# Altium project IF GAIN.PrjPcb
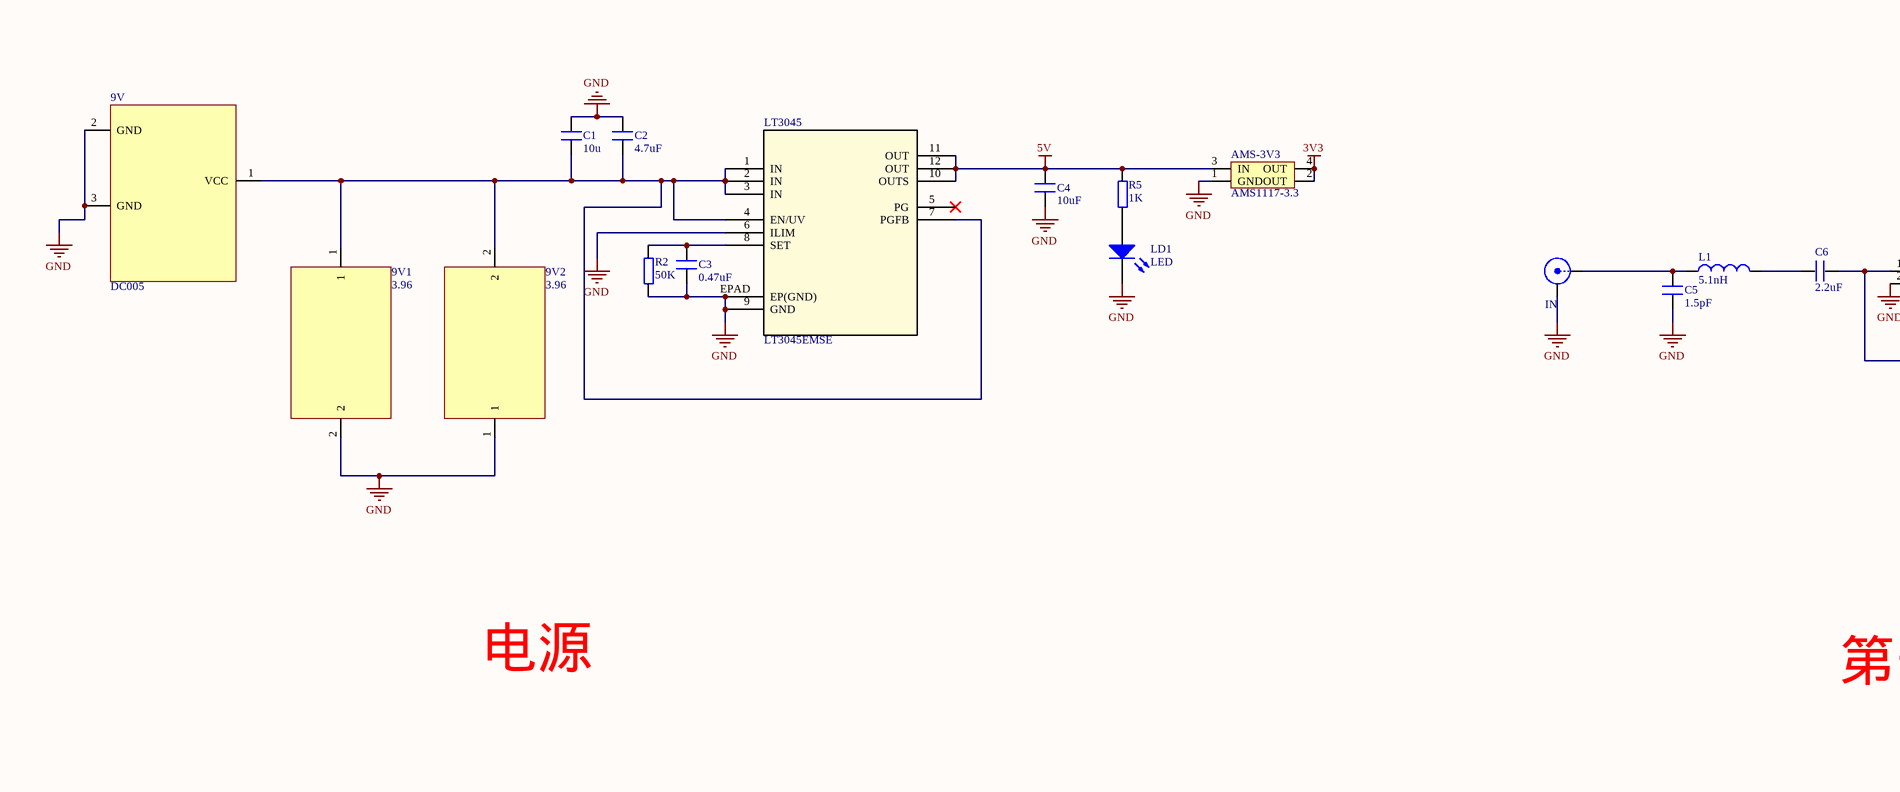
[diagram p0: IF GAIN].SchDoc, top left]
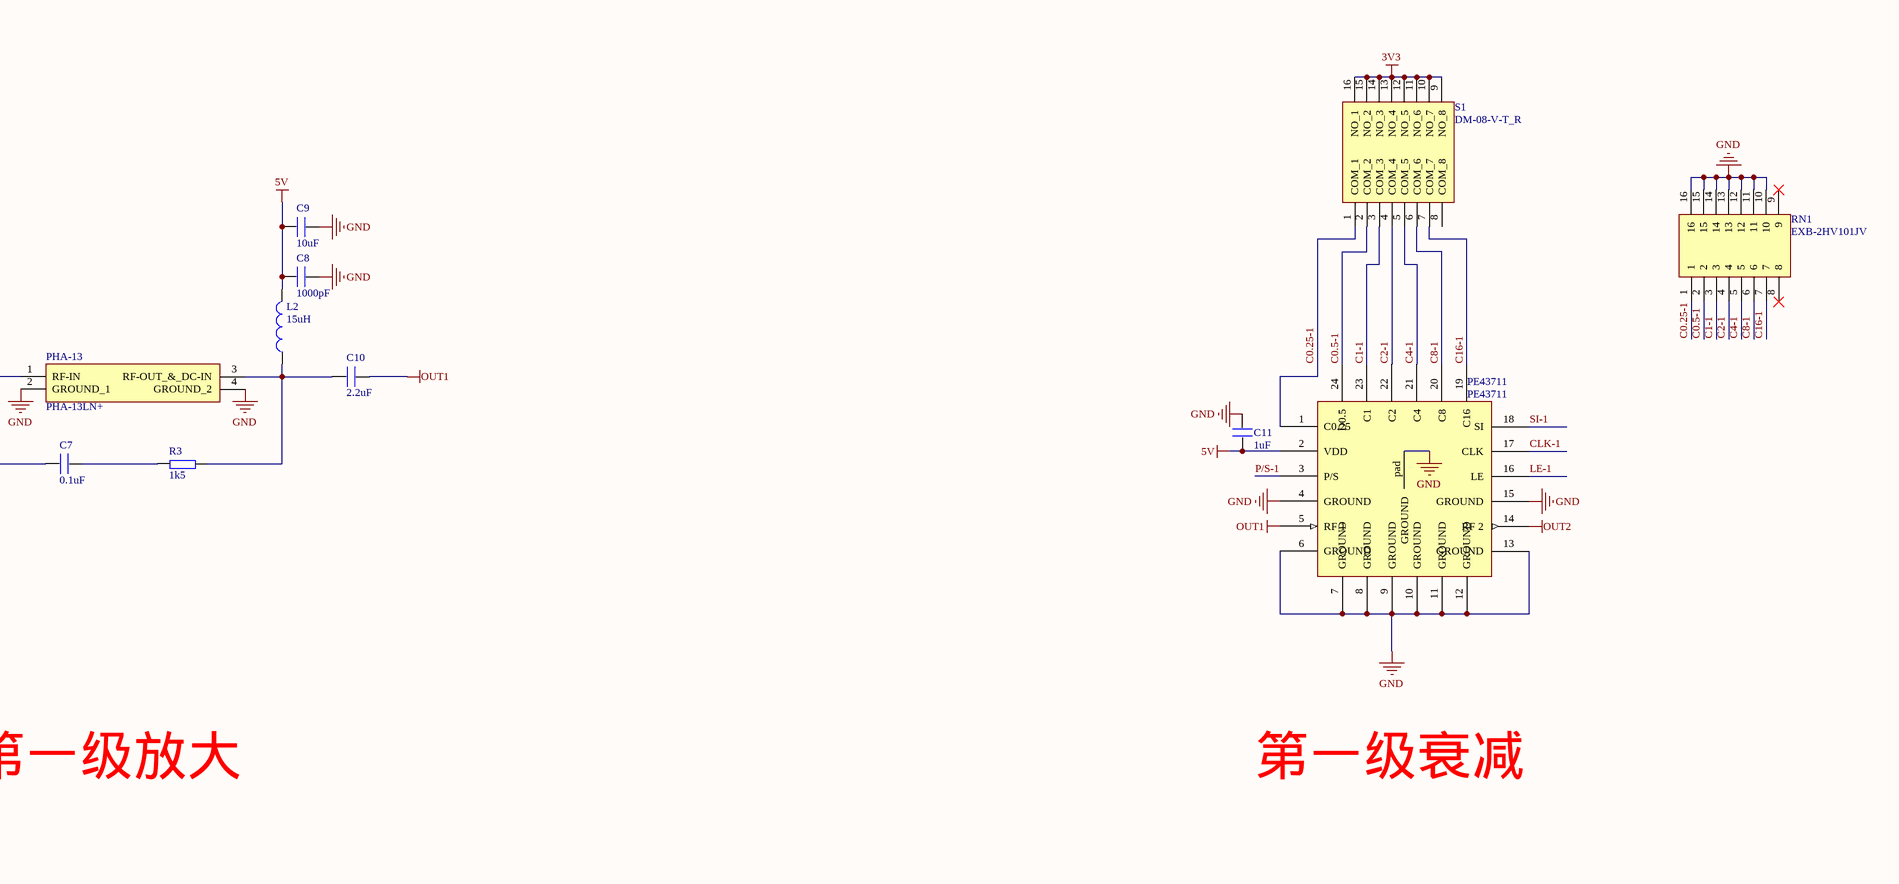
[diagram p1: IF GAIN].SchDoc, top right]
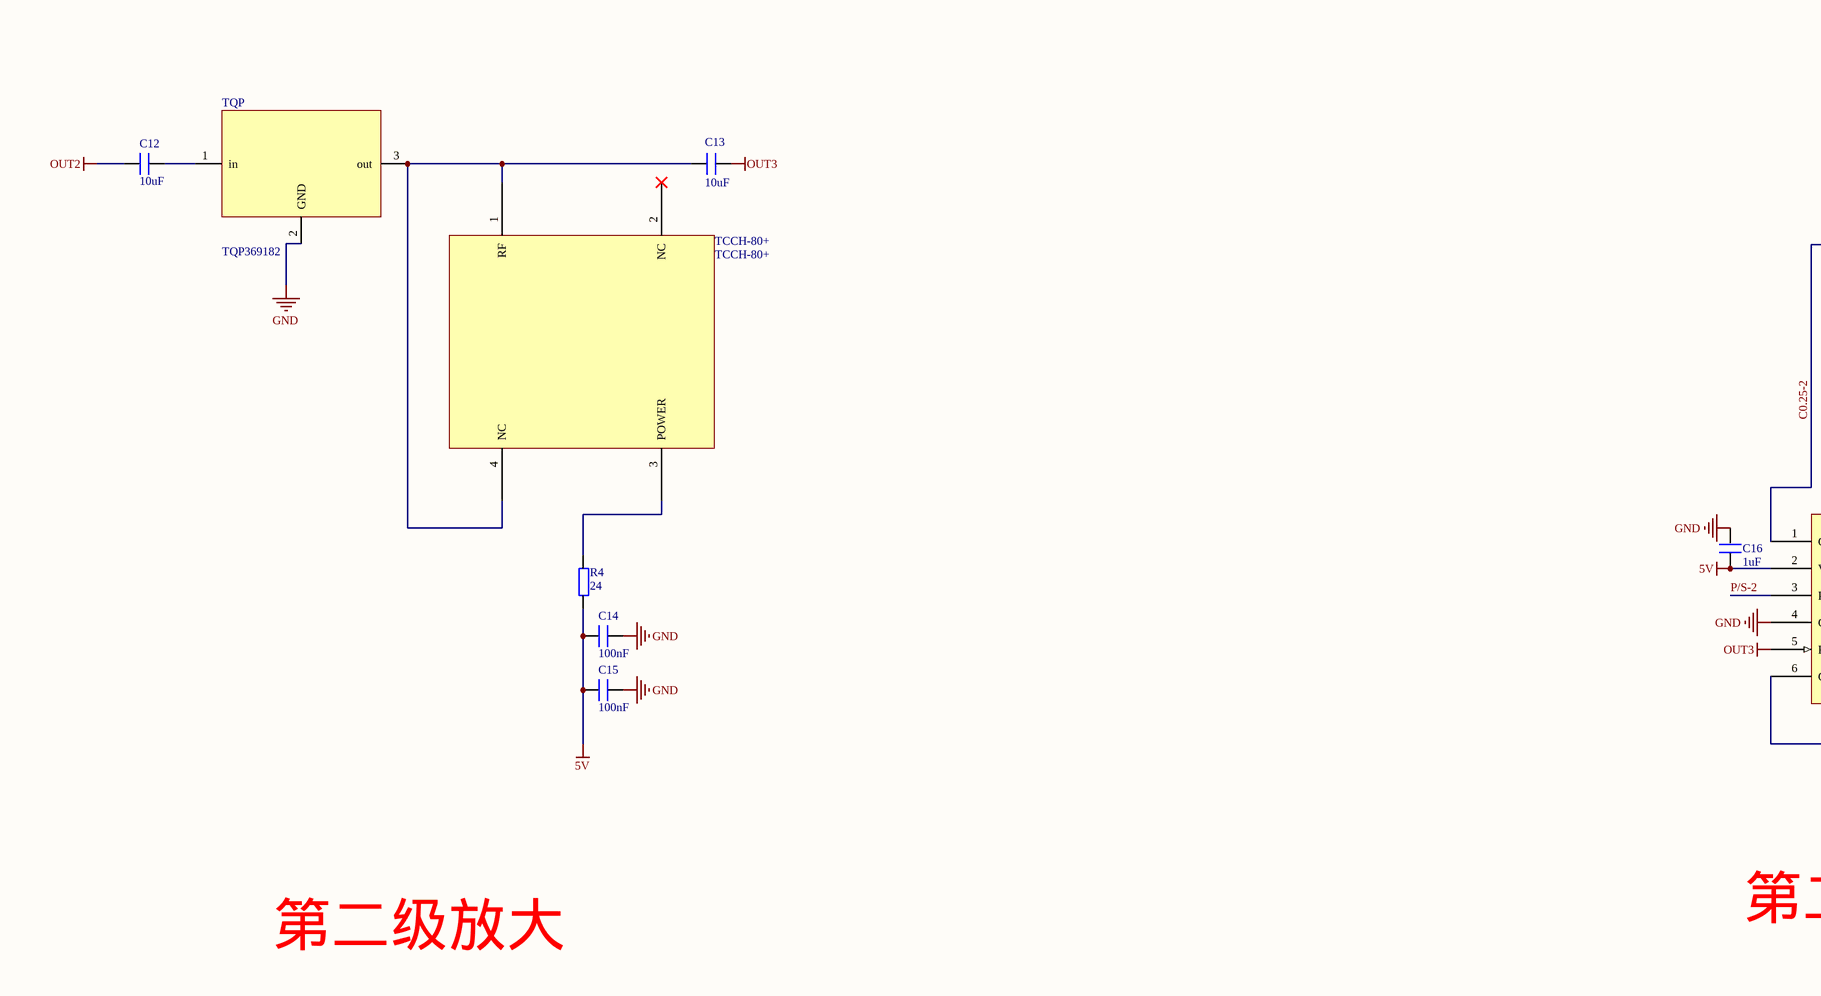
[diagram p2: IF GAIN].SchDoc, bottom left]
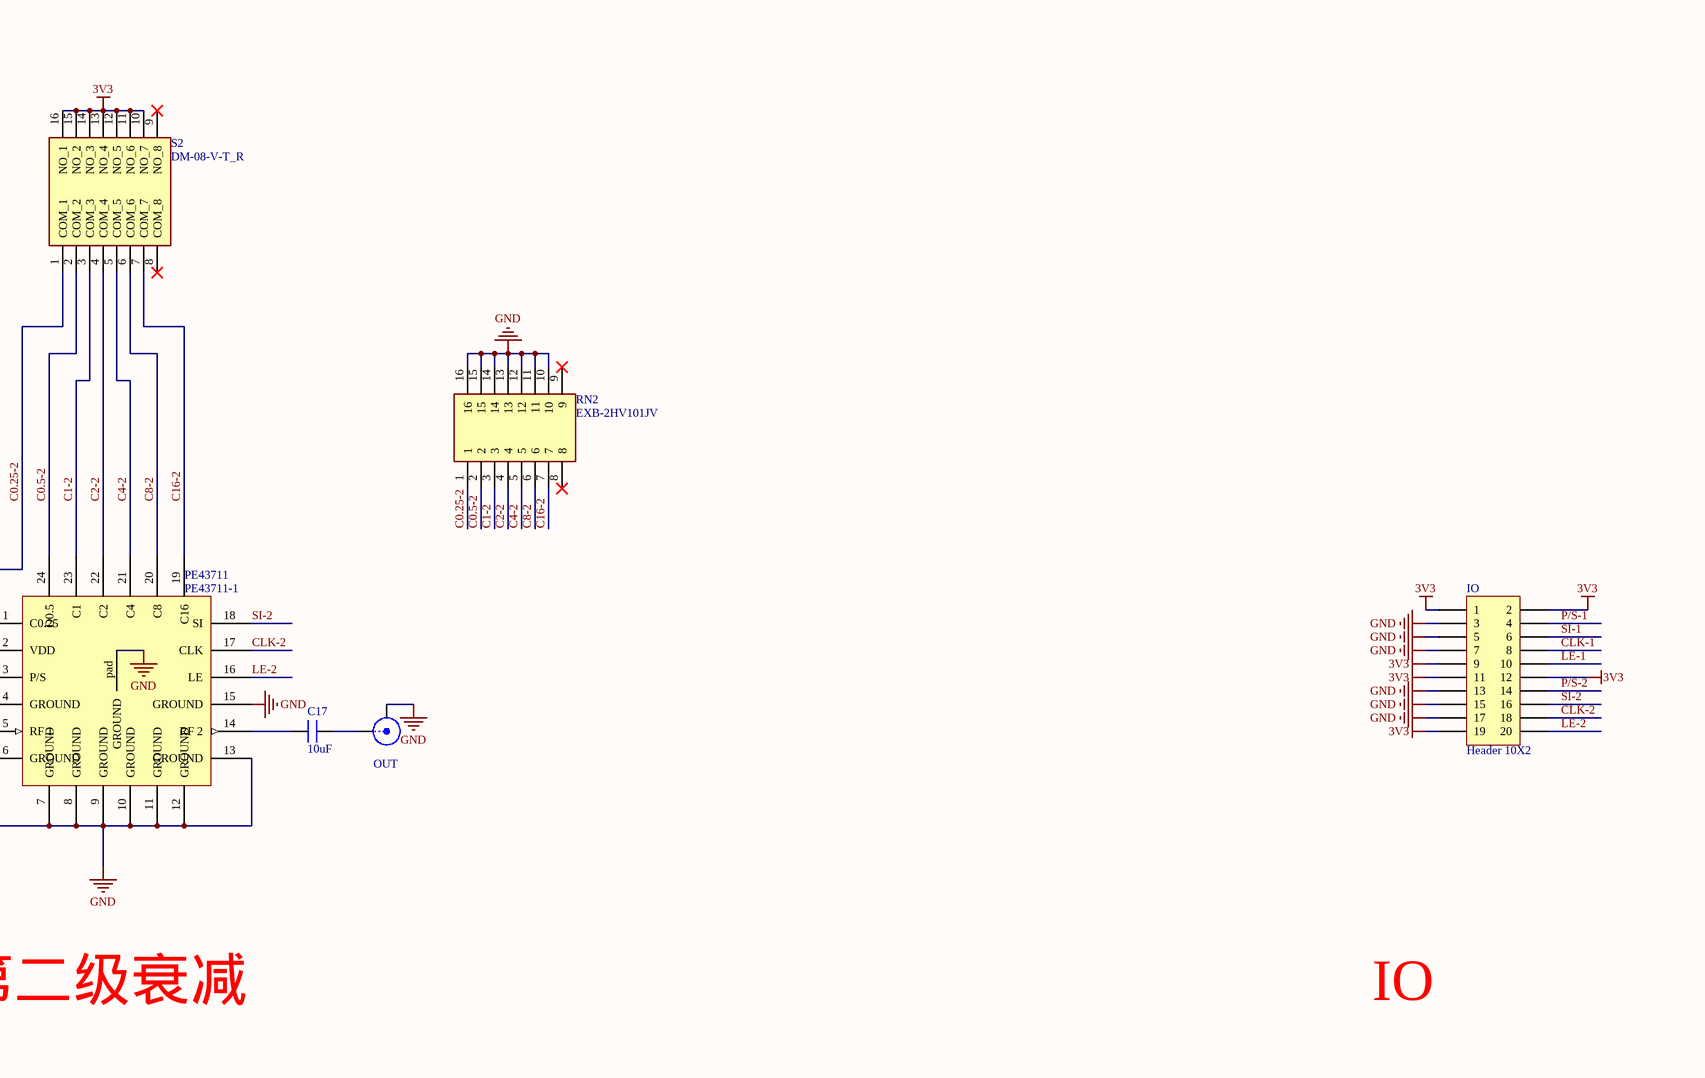
[diagram p3: IF GAIN].SchDoc, bottom right]
1 sheet, 41 parts. Net scope: global (net labels, ports and power ports of the same name join across sheets).
Board file: IF GAIN.PcbDoc

## Sheet IF GAIN].SchDoc
size A1

### Parts
9V  DC005  [DC10B]
9V1  3.96  [3.96]
9V2  3.96  [3.96]
AMS-3V3  AMS1117-3.3  [AMS1117]
C1  10u  [0603C]
C2  4.7uF  [0603C]
C3  0.47uF  [0402]
C4  10uF  [0402]
C5  1.5pF  [0402]
C6  2.2uF  [0402]
C7  0.1uF  [0402]
C8  1000pF  [0402]
C9  10uF  [0603C]
C10  2.2uF  [0402]
C11  1uF  [0402]
C12  10uF  [0402]
C13  10uF  [0402]
C14  100nF  [0603C]
C15  100nF  [0603C]
C16  1uF  [0402]
C17  10uF  [0402]
IN  SMA  [SMA]  (value not drawn)
IO  Header 10X2  [HDR2X10]
L1  5.1nH  [0402]
L2  15uH  [1206C]
LD1  LED  [SMDLED]
LT3045  LT3045EMSE  [MSOP12-MSE-RevG_ADI]
OUT  SMA  [SMA]  (value not drawn)
PE43711  PE43711  [PE43711]
PE43711-1  PE43711  [PE43711]
PHA-13  PHA-13LN+  [PHA13LN]
R2  50K  [0402]
R3  1k5  [0402]
R4  24  [1206]
R5  1K  [0603R]
RN1  EXB-2HV101JV  [EXB2HV101JV]
RN2  EXB-2HV101JV  [EXB2HV101JV]
S1  DM-08-V-T_R  [DM08VTR]
S2  DM-08-V-T_R  [DM08VTR]
TCCH-80+  TCCH-80+  [GU1604]
TQP  TQP369182  [SOT89_M]

### Nets
3V3: AMS-3V3.2(OUT) AMS-3V3.4(OUT) IO.1 IO.2 IO.9 IO.11 IO.12 IO.19 S1.9(NO_8) S1.10(NO_7) S1.11(NO_6) S1.12(NO_5) S1.13(NO_4) S1.14(NO_3) S1.15(NO_2) S1.16(NO_1) S2.10(NO_7) S2.11(NO_6) S2.12(NO_5) S2.13(NO_4) S2.14(NO_3) S2.15(NO_2) S2.16(NO_1)
5V: AMS-3V3.3(IN) C4.2 C8.2 C9.2 C11.1 C14.1 C15.1 C16.1 L2.2 LT3045.10(OUTS) LT3045.11(OUT) LT3045.12(OUT) PE43711.2(VDD) PE43711-1.2(VDD) R4.1 R5.2
GND: 9V.2(GND) 9V.3(GND) 9V1.2 9V2.1 AMS-3V3.1(GND) C1.2 C2.2 C3.1 C4.1 C5.1 C8.1 C9.1 C11.2 C14.2 C15.2 C16.2 IN.2(Y) IO.3 IO.5 IO.7 IO.13 IO.15 IO.17 LD1.2(K) LT3045.6(ILIM) LT3045.9(GND) LT3045.EPAD(EP(GND)) OUT.2(Y) PE43711.4(GROUND) PE43711.6(GROUND) PE43711.7(GROUND) PE43711.8(GROUND) PE43711.9(GROUND) PE43711.10(GROUND) PE43711.11(GROUND) PE43711.12(GROUND) PE43711.13(GROUND) PE43711.15(GROUND) PE43711.pad(GROUND) PE43711-1.4(GROUND) PE43711-1.6(GROUND) PE43711-1.7(GROUND) PE43711-1.8(GROUND) PE43711-1.9(GROUND) PE43711-1.10(GROUND) PE43711-1.11(GROUND) PE43711-1.12(GROUND) PE43711-1.13(GROUND) PE43711-1.15(GROUND) PE43711-1.pad(GROUND) PHA-13.2(GROUND_1) PHA-13.4(GROUND_2) R2.1 RN1.10 RN1.11 RN1.12 RN1.13 RN1.14 RN1.15 RN1.16 RN2.10 RN2.11 RN2.12 RN2.13 RN2.14 RN2.15 RN2.16 TQP.2(GND)
OUT1: C10.1 PE43711.5(RF_1)
OUT2: C12.1 PE43711.14(RF_2)
OUT3: C13.2 PE43711-1.5(RF_1)
C0.5-1: PE43711.24(D0.5) RN1.2 S1.2(COM_2)
C0.5-2: PE43711-1.24(D0.5) RN2.2 S2.2(COM_2)
C0.25-1: PE43711.1(C0.25) RN1.1 S1.1(COM_1)
C0.25-2: PE43711-1.1(C0.25) RN2.1 S2.1(COM_1)
C1-1: PE43711.23(C1) RN1.3 S1.3(COM_3)
C1-2: PE43711-1.23(C1) RN2.3 S2.3(COM_3)
C2-1: PE43711.22(C2) RN1.4 S1.4(COM_4)
C2-2: PE43711-1.22(C2) RN2.4 S2.4(COM_4)
C4-1: PE43711.21(C4) RN1.5 S1.5(COM_5)
C4-2: PE43711-1.21(C4) RN2.5 S2.5(COM_5)
C8-1: PE43711.20(C8) RN1.6 S1.6(COM_6)
C8-2: PE43711-1.20(C8) RN2.6 S2.6(COM_6)
C16-1: PE43711.19(C16) RN1.7 S1.7(COM_7)
C16-2: PE43711-1.19(C16) RN2.7 S2.7(COM_7)
CLK-1: IO.8 PE43711.17(CLK)
CLK-2: IO.18 PE43711-1.17(CLK)
LE-1: IO.10 PE43711.16(LE)
LE-2: IO.20 PE43711-1.16(LE)
P/S-1: IO.4 PE43711.3(P/S)
P/S-2: IO.14 PE43711-1.3(P/S)
SI-1: IO.6 PE43711.18(SI)
SI-2: IO.16 PE43711-1.18(SI)
Net9V_1: 9V.1(VCC) 9V1.1 9V2.2 C1.1 C2.1 LT3045.1(IN) LT3045.2(IN) LT3045.3(IN) LT3045.4(EN/UV) LT3045.7(PGFB)
NetC3_2: C3.2 LT3045.8(SET) R2.2
NetC5_2: C5.2 IN.1(X) L1.1
NetC6_1: C6.1 C7.2 PHA-13.1(RF-IN)
NetC6_2: C6.2 L1.2
NetC7_1: C7.1 R3.1
NetC10_2: C10.2 L2.1 PHA-13.3(RF-OUT_&_DC-IN) R3.2
NetC12_2: C12.2 TQP.1(in)
NetC13_1: C13.1 TCCH-80+.1(RF) TCCH-80+.4(NC) TQP.3(out)
NetC17_1: C17.1 PE43711-1.14(RF_2)
NetC17_2: C17.2 OUT.1(X)
NetLD1_1: LD1.1(A) R5.1
NetR4_2: R4.2 TCCH-80+.3(POWER)

Not connected (* = marked no-connect by the designer): LT3045 5(PG)*; RN1 8* 9*; RN2 8* 9*; S1 8(COM_8); S2 8(COM_8)* 9(NO_8)*; TCCH-80+ 2(NC)*

### Notes on the sheet
- 电源
- 第一级放大
- 第一级衰减
- 第二级放大
- 第二级衰减
- IO

### Library data of the parts
AMS-3V3 = AMS1117
C1-C17 = C: Capacitor
IN OUT = SMA: SMA Connector
IO = Header 10X2: Header, 10-Pin, Dual row; LatestRevisionDate: 17-Jul-2002; LatestRevisionNote: Re-released for DXP Platform.; Publisher: Altium Limited
L1 L2 = Inductor: Value: 100uH; Published: 8-Jun-2000; Revision: July-2002: Re-released for DXP Platform.; Publisher: Altium Limited
LD1 = LED: Typical RED, GREEN, YELLOW, AMBER GaAs LED; Published: 8-Jun-2000; LatestRevisionDate: 17-Jul-2002; LatestRevisionNote: Re-released for DXP Platform.; PackageDocument: Feb-2002; PackageReference: 3.2X1.6X1.1; Publisher: Altium Limited
LT3045 = LT3045EMSE: No Description Available; SourceLibrary: Analog_Devices_Inc_2020-09-15; Built_By: SunStream; Vendor: Analog Devices Inc; Copyright: Copyright (C) 2018 Accelerated Designs. All rights reserved; Manufacturer_Part_Number: LT3045EMSE; RefDes: RefDes; Type: DEV
PHA-13 = PHA-13LN+: Integrated Circuit; Manufacturer_Name: Mini-Circuits; Datasheet Link: https://www.minicircuits.com/pdfs/PHA-13LN+.pdf; Height: 1.6mm; Manufacturer_Part_Number: PHA-13LN+; Mouser Part Number: 139-PHA-13LN; Mouser Price/Stock: https://www.mouser.co.uk/ProductDetail/Mini-Circuits/PHA-13LN%2b?qs=xZ%2FP%252Ba9zWqYkwnUBoTp7PQ%3D%3D
R2-R5 = Resistor
RN1 RN2 = EXB-2HV101JV: Resistor Network; Manufacturer_Name: Panasonic; Datasheet Link: https://industrial.panasonic.com/cdbs/www-data/pdf/AOC0000/AOC0000C14.pdf; Height: 0.55mm; Manufacturer_Part_Number: EXB-2HV101JV; Mouser Part Number: 667-EXB-2HV101JV; Mouser Price/Stock: https://www.mouser.co.uk/ProductDetail/Panasonic/EXB-2HV101JV?qs=oE3VwAv%2FYtkI4Sp%252Bk267NQ%3D%3D; Arrow Part Number: EXB-2HV101JV; Arrow Price/Stock: https://www.arrow.com/en/products/exb-2hv101jv/panasonic
S1 S2 = DM-08-V-T_R: Switch; Manufacturer_Name: Diptronics; Manufacturer_Part_Number: DM-08-V-T/R; Datasheet Link: http://www.dip.com.tw/en/en-product-information/en-switch002/item/download/2412_2ffa0571076f7652f42c65d9d72a148c; Height: 3.15mm